# EAGLE design RPi_SPI_inputs_v04 (EAGLE 7.2.0)
AUTHOR: M.Petrilak; VERSION: 03
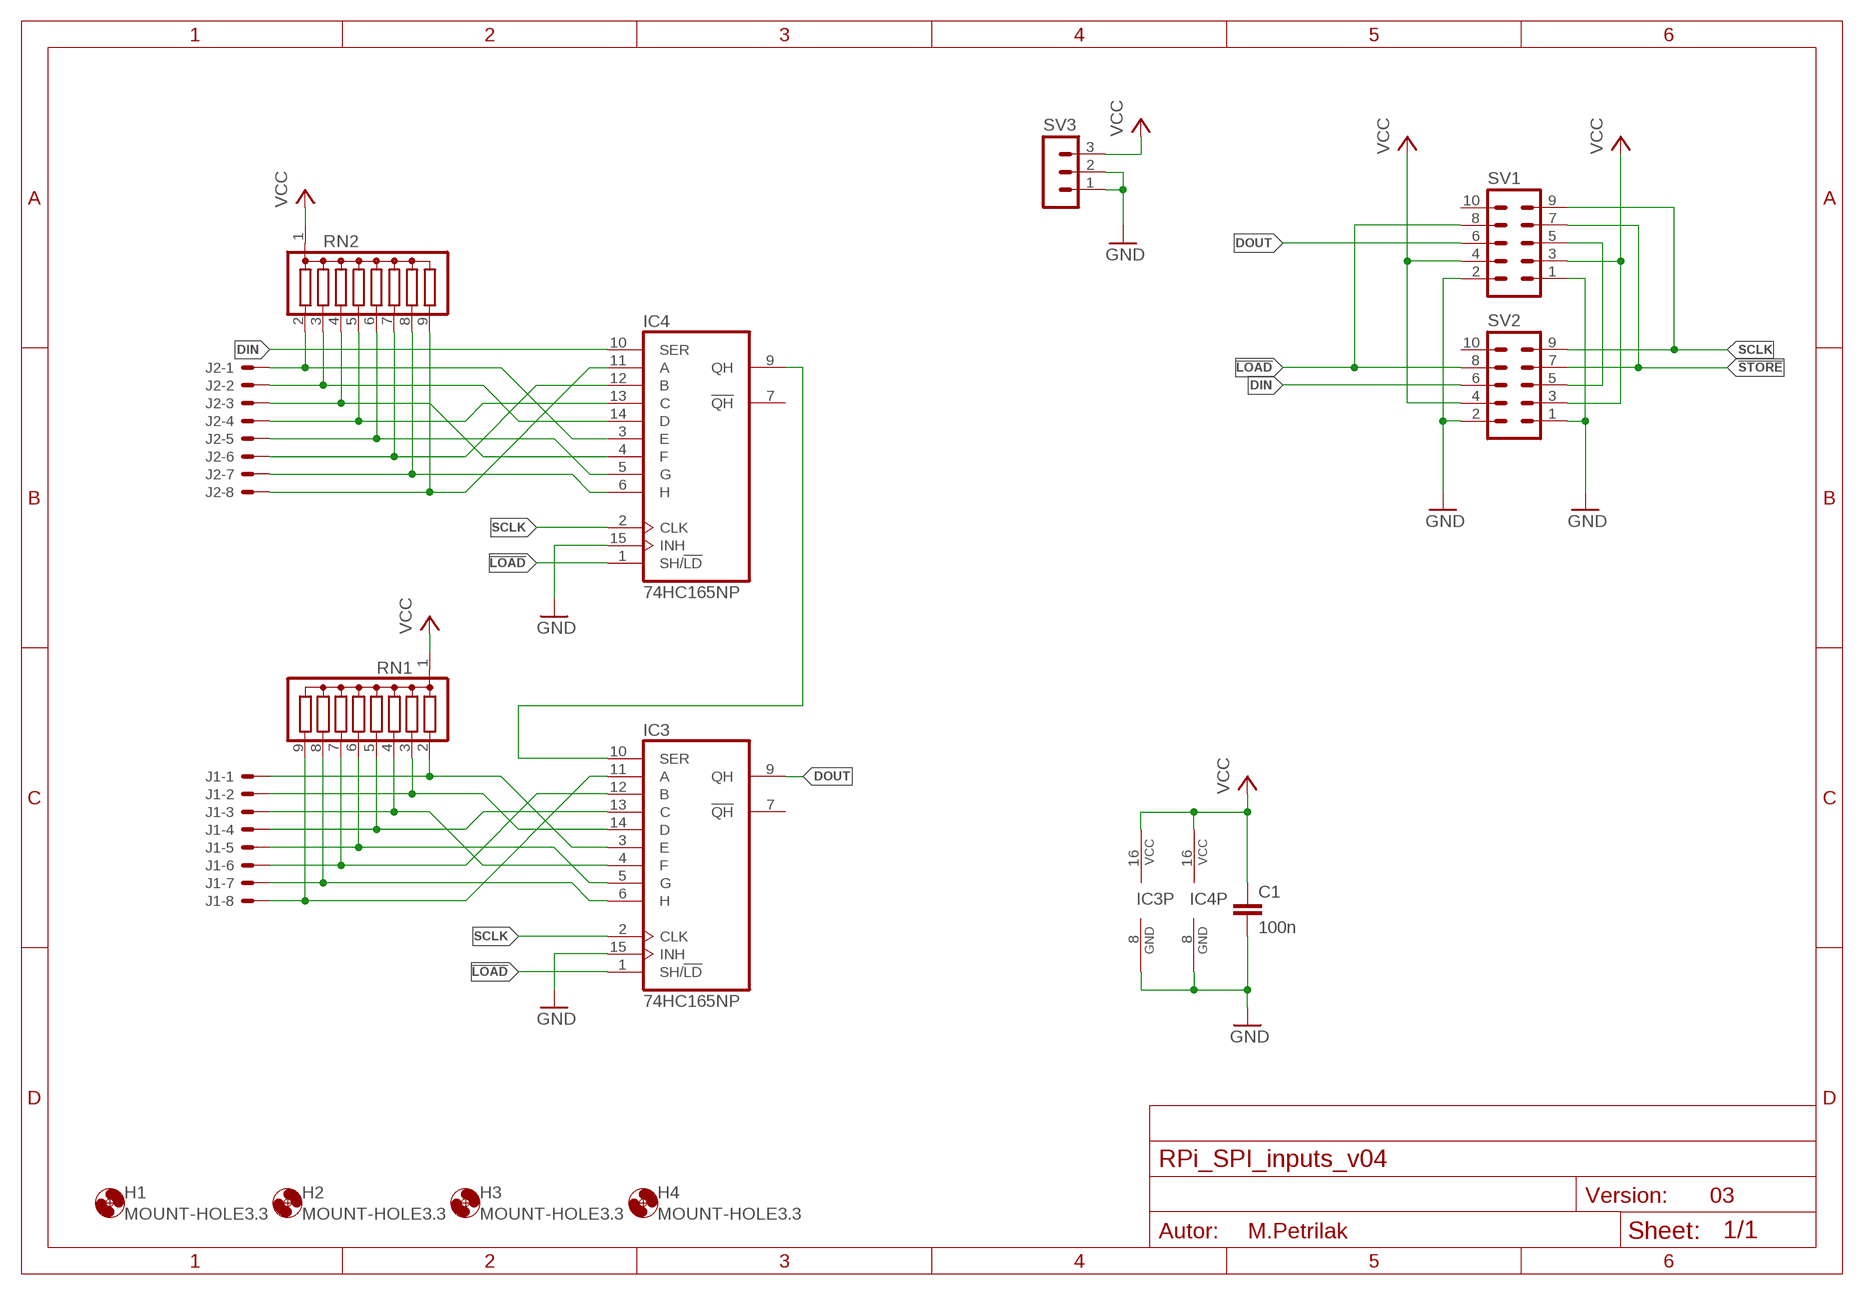
[diagram p0: schematic, sheet 1]

## Parts
C1  100n  C-EUC1206  [C1206]
H1  MOUNT-HOLE3.3  [3,3]
H2  MOUNT-HOLE3.3  [3,3]
H3  MOUNT-HOLE3.3  [3,3]
H4  MOUNT-HOLE3.3  [3,3]
IC3  74HC165NP  [SOCKET-16]
IC4  74HC165NP  [SOCKET-16]
J1  22-05-7088-SPEC-08  [7395-08_SPEC]
J2  22-05-7088-SPEC-08  [7395-08_SPEC]
RN1  G08R  [SIL9]
RN2  G08R  [SIL9]
SV1  ML10  [ML10]
SV2  ML10  [ML10]
SV3  MA03-1_NO  [MA03-1_NO]

## Nets
!LOAD: IC3.1(SH/!LD) IC4.1(SH/!LD) SV1.8 SV2.8
!STORE: SV1.7 SV2.7
DIN: IC4.10(SER) SV2.6
DOUT: IC3.9(QH) SV1.6
DRET: SV1.5 SV2.5
GND: C1.2 IC3.8(GND) IC3.15(INH) IC4.8(GND) IC4.15(INH) SV1.1 SV1.2 SV2.1 SV2.2 SV3.1 SV3.2
N$1: IC4.11(A) J2.8 RN2.9
N$2: IC4.6(H) J2.7 RN2.8
N$3: IC3.10(SER) IC4.9(QH)
N$4: IC4.12(B) J2.6 RN2.7
N$5: IC4.5(G) J2.5 RN2.6
N$6: IC4.13(C) J2.4 RN2.5
N$7: IC4.4(F) J2.3 RN2.4
N$8: IC4.14(D) J2.2 RN2.3
N$9: IC4.3(E) J2.1 RN2.2
N$22: IC3.3(E) J1.1 RN1.2
N$23: IC3.14(D) J1.2 RN1.3
N$24: IC3.4(F) J1.3 RN1.4
N$25: IC3.13(C) J1.4 RN1.5
N$26: IC3.5(G) J1.5 RN1.6
N$27: IC3.12(B) J1.6 RN1.7
N$28: IC3.6(H) J1.7 RN1.8
N$29: IC3.11(A) J1.8 RN1.9
SCLK: IC3.2(CLK) IC4.2(CLK) SV1.9 SV2.9
VCC: C1.1 IC3.16(VCC) IC4.16(VCC) RN1.1 RN2.1 SV1.3 SV1.4 SV2.3 SV2.4 SV3.3
Unconnected: IC3.7(!QH) IC4.7(!QH) SV1.10 SV2.10

## Library data of the parts
C1 = rcl:C-EU: CAPACITOR, European symbol
H1-H4 = holes:MOUNT-HOLE: MOUNTING HOLE with drill center marker
IC3 IC4 = 74xx-us:74*165: 8-bit parallel load SHIFT REGISTER
J1 J2 = con-molex:22-?-08: CONNECTOR wire to board 2.54 mm (.1 inch) pitch header
RN1 RN2 = resistor-sil:G08R: SIL RESISTOR
SV1 SV2 = con-harting-ml:ML10: HARTING
SV3 = con-lstb:MA03-1: PIN HEADER

## Board
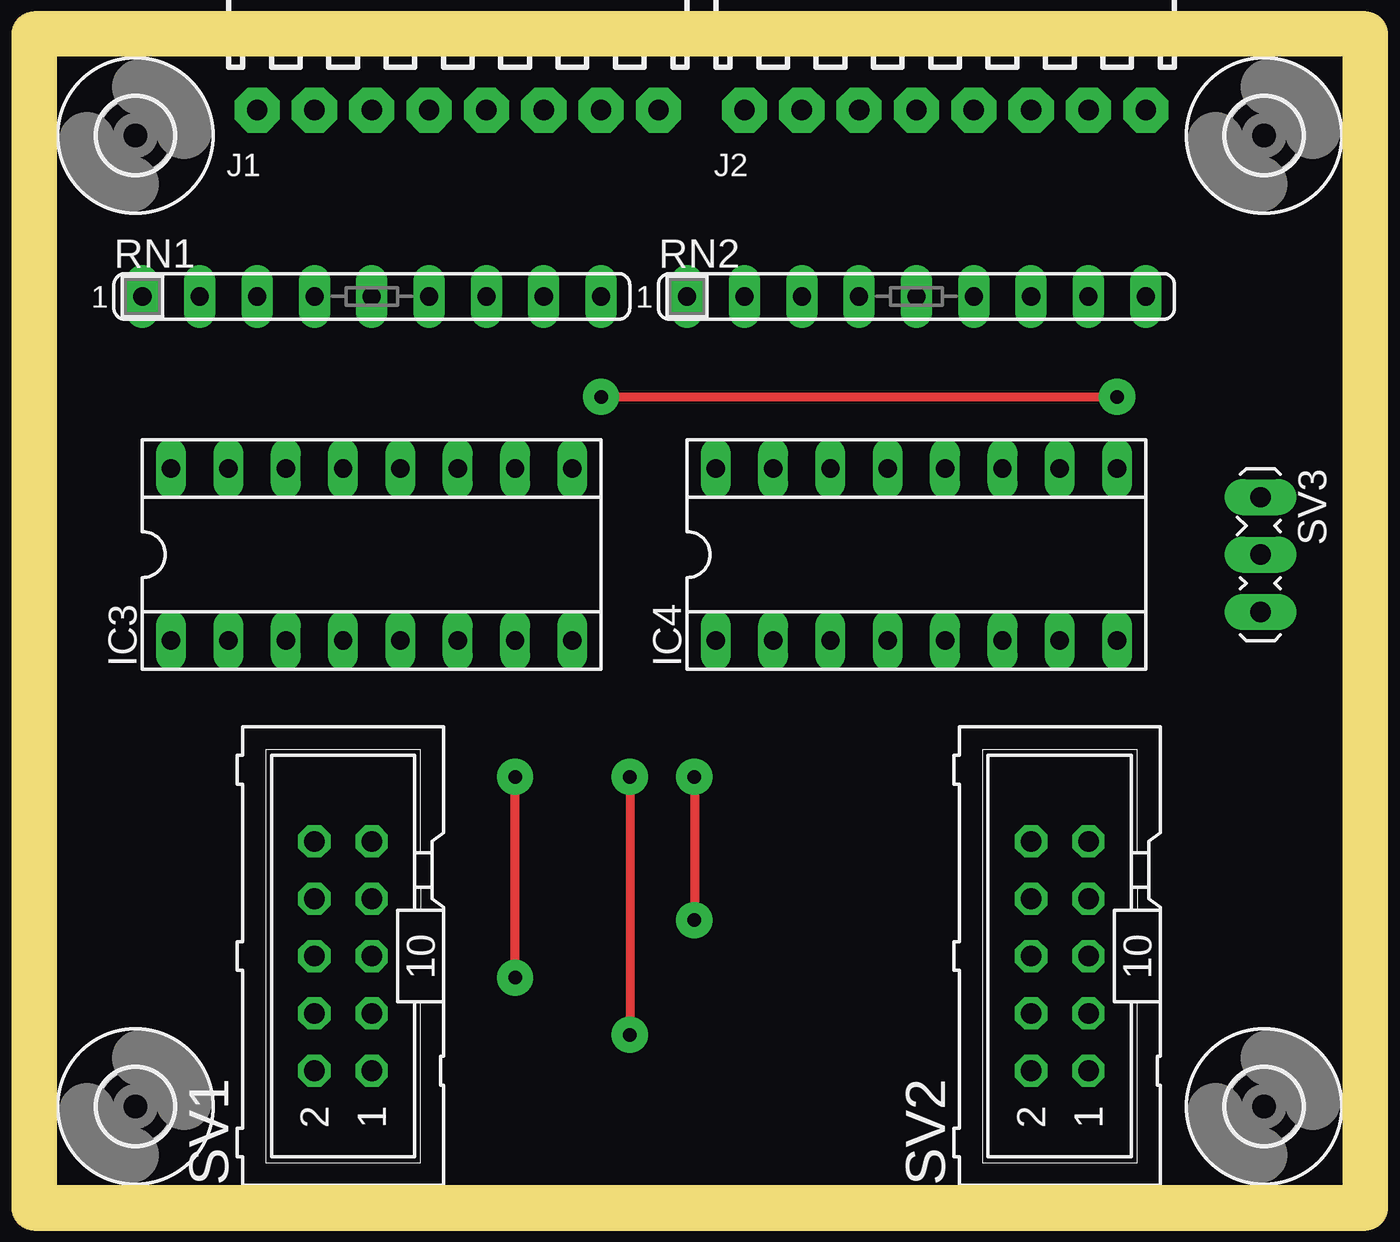
[diagram p1: board, top side]
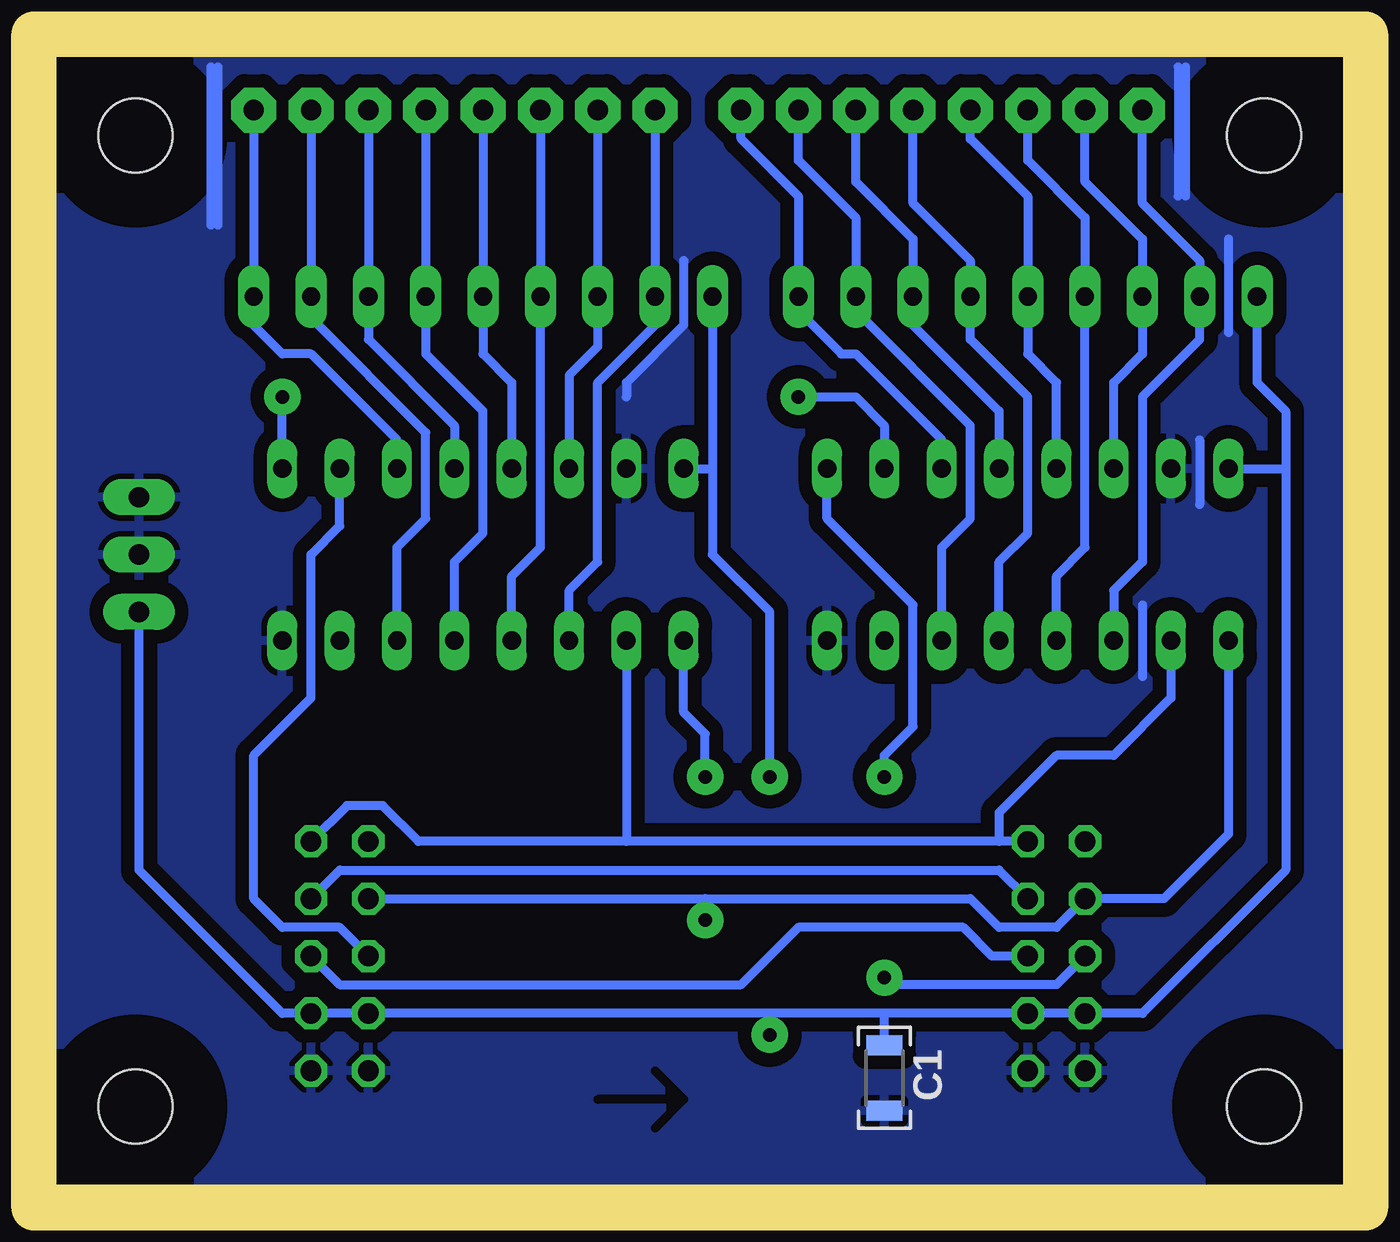
[diagram p2: board, bottom side, seen from below]

Size 57 x 50 mm. Coordinates in mm from the lower left corner, seen from the top.
Outline: 0,0 57,0 57,50 0,50 0,0
Copper layers (1*16): Top 0.035mm / dielectric 1.5mm / Bottom 0.035mm
Design rules "Michal_CNC_doma *": minimum track width 0.3mm, minimum drill 0.6mm, track to track 0.6mm, track to pad 0.6mm, pad to pad 0.4mm, via to via 0.4mm, smd to smd 8mil, copper to edge 1mil, drill to drill 8mil, minimum pad ring 10mil, minimum via ring 8mil, stop-mask expansion 4mil, vias tented up to drill 0mil, thermal gap 10mil
bRestrict: 3 lines
Milling: 4 lines

### Footprints (pad centres in the part's own frame; a part is rotated, then mirrored left to right if it is on the bottom)
C1206 = smd 0.9 x 1.6: 1 -1.45,0; 2 1.45,0
3,3 = hole 3.3: 0,0
SOCKET-16 = drill 0.813 long: 1 -8.89,-3.81; 2 -6.35,-3.81; 3 -3.81,-3.81; 4 -1.27,-3.81; 5 1.27,-3.81; 6 3.81,-3.81; 7 6.35,-3.81; 8 8.89,-3.81; 9 8.89,3.81; 10 6.35,3.81; 11 3.81,3.81; 12 1.27,3.81; 13 -1.27,3.81; 14 -3.81,3.81; 15 -6.35,3.81; 16 -8.89,3.81
7395-08_SPEC = drill 0.9 pad 2 octagon: 1 8.89,0; 2 6.35,0; 3 3.81,0; 4 1.27,0; 5 -1.27,0; 6 -3.81,0; 7 -6.35,0; 8 -8.89,0
SIL9 = drill 0.8 pad 1.4 long: 1 -10.16,0; 2 -7.62,0; 3 -5.08,0; 4 -2.54,0; 5 0,0; 6 2.54,0; 7 5.08,0; 8 7.62,0; 9 10.16,0
ML10 = drill 0.914 octagon: 1 -5.08,-1.27; 2 -5.08,1.27; 3 -2.54,-1.27; 4 -2.54,1.27; 5 0,-1.27; 6 0,1.27; 7 2.54,-1.27; 8 2.54,1.27; 9 5.08,-1.27; 10 5.08,1.27
MA03-1_NO = drill 0.9 pad 1.6 long: 1 -2.54,0; 2 0,0; 3 2.54,0

### Placement (x,y rotation side)
C1  20.32,4.76 270 bottom
H1  3.5,3.5 0 top
H2  53.5,3.5 0 top
H3  53.5,46.5 0 top
H4  3.5,46.5 0 top
IC3  13.97,27.94 0 top
IC4  38.1,27.94 0 top
J1  17.78,47.62 180 top
J2  39.37,47.62 180 top
RN1  13.97,39.37 0 top
RN2  38.1,39.37 0 top
SV1  12.7,10.16 90 top
SV2  44.45,10.16 90 top
SV3  53.34,27.94 270 top

### Tracks (layer width: path | path; a pad name or v marks a point on that pad's centre or on a via)
!LOAD  (via drill 0.6 pad 1.6)
  Top 0.406: v28.26,18.1 v28.26,11.75
  Bottom 0.406: IC3.1 5.08,15.56 7.94,12.7 SV1.8 12.7,11.43 15.24,11.43 16.51,12.7 28.26,12.7 | v28.26,18.1 28.26,20 29.21,20.95 IC4.1 | SV2.8 28.26,12.7 | v28.26,11.75 28.26,12.7
!STORE
  Bottom 0.406: SV2.7 44.45,13.97 15.24,13.97 SV1.7
DIN
  Bottom 0.406: SV2.6 44.45,11.43 46.99,11.43 48.26,12.7 48.26,19.05 45.72,21.59 45.72,27.94 44.45,29.21 IC4.10
DOUT  (via drill 0.6 pad 1.6)
  Top 0.406: v20.32,9.21 v20.32,18.1
  Bottom 0.406: v20.32,18.1 20.32,19.05 19.05,20.32 19.05,25.72 22.86,29.53 IC3.9 | SV1.6 12.7,8.89 20,8.89 v20.32,9.21
DRET
  Bottom 0.406: SV2.5 44.45,8.89 26.67,8.89 24.13,11.43 16.83,11.43 15.56,10.16 SV1.5
GND
  Bottom 0.406: 6.35,33.02 6.35,30.16 | 8.89,25.72 8.89,22.54 | 29.21,40.96 29.21,38.1 31.75,35.56 31.75,34.92 | 5.08,41.91 5.08,37.78 | 49.85,42.55 49.85,43.18 49.85,48.9 49.85,49.53 | 6.99,49.53 6.99,43.81 | 7.3,49.53 7.3,43.81 | 50.16,42.55 50.16,43.18 50.16,48.9 50.16,49.53
  pour Bottom: 0,0 57,0 57,50 0,50
N$1
  Bottom 0.406: J2.8 RN2.9 48.26,38.1 46.99,36.83 45.72,36.83 41.91,33.02 IC4.11
N$2
  Bottom 0.406: J2.7 RN2.8 45.72,38.42 40.64,33.34 40.64,29.53 41.91,28.26 IC4.6
N$3  (via drill 0.6 pad 1.6)
  Top 0.406: v24.13,34.92 v46.99,34.92
  Bottom 0.406: v24.13,34.92 21.59,34.92 20.32,33.66 IC3.10 | IC4.9 v46.99,34.92
N$4
  Bottom 0.406: J2.6 RN2.7 43.18,37.47 39.37,33.66 IC4.12
N$5
  Bottom 0.406: J2.5 RN2.6 40.64,36.83 38.1,34.29 38.1,28.89 39.37,27.62 IC4.5
N$6
  Bottom 0.406: J2.4 RN2.5 38.1,36.83 36.83,35.56 IC4.13
N$7
  Bottom 0.406: J2.3 RN2.4 35.56,28.26 36.83,26.99 IC4.4
N$8
  Bottom 0.406: J2.2 RN2.3 33.02,37.15 34.29,35.88 IC4.14
N$9
  Bottom 0.406: J2.1 RN2.2 30.48,38.1 33.02,35.56 33.02,27.62 34.29,26.35 IC4.3
N$22
  Bottom 0.406: J1.1 8.89,43.5 6.35,40.96 RN1.2 6.35,37.47 8.89,34.92 8.89,27.62 10.16,26.35 IC3.3
N$23
  Bottom 0.406: J1.2 11.43,44.45 8.89,41.91 RN1.3 8.89,36.83 10.16,35.56 IC3.14
N$24
  Bottom 0.406: J1.3 13.97,45.4 11.43,42.86 RN1.4 11.43,28.26 12.7,26.99 IC3.4
N$25
  Bottom 0.406: J1.4 16.51,46.35 13.97,43.81 RN1.5 13.97,36.83 12.7,35.56 IC3.13
N$26
  Bottom 0.406: J1.5 19.05,43.5 16.51,40.96 RN1.6 16.51,37.47 13.97,34.92 13.97,28.89 15.24,27.62 IC3.5
N$27
  Bottom 0.406: J1.6 21.59,44.45 19.05,41.91 RN1.7 19.05,38.1 15.24,34.29 IC3.12
N$28
  Bottom 0.406: J1.7 24.13,45.4 21.59,42.86 RN1.8 21.59,38.73 16.51,33.66 16.51,29.53 17.78,28.26 IC3.6
N$29
  Bottom 0.406: J1.8 26.67,46.35 24.13,43.81 RN1.9 24.13,38.73 22.23,36.83 21.59,36.83 17.78,33.02 IC3.11
SCLK
  Bottom 0.406: SV1.9 15.24,15.24 | 15.24,15.24 31.75,15.24 | 31.75,15.24 40.96,15.24 42.55,16.83 44.13,16.83 SV2.9 | IC3.2 7.62,21.59 10.16,19.05 12.7,19.05 15.24,16.51 15.24,15.24 | IC4.2 31.75,15.24
VCC  (via drill 0.6 pad 1.6)
  Top 0.406: v25.4,18.1 v25.4,6.67
  Bottom 0.406: 20.32,7.62 SV1.3 SV1.4 8.89,7.62 2.54,13.97 2.54,31.75 | 20.32,7.62 25.4,7.62 | 25.4,7.62 SV2.4 SV2.3 46.99,7.62 53.34,13.97 SV3.3 | C1.1 20.32,7.62 | v25.4,6.67 25.4,7.62 | v25.4,18.1 25.4,25.4 27.94,27.94 27.94,31.75 | 2.54,31.75 2.54,34.29 3.81,35.56 RN1.1 | IC3.16 2.54,31.75 | RN2.1 27.94,31.75 | IC4.16 27.94,31.75